# EAGLE design BeanCounter_V10 (EAGLE 9.6.2)
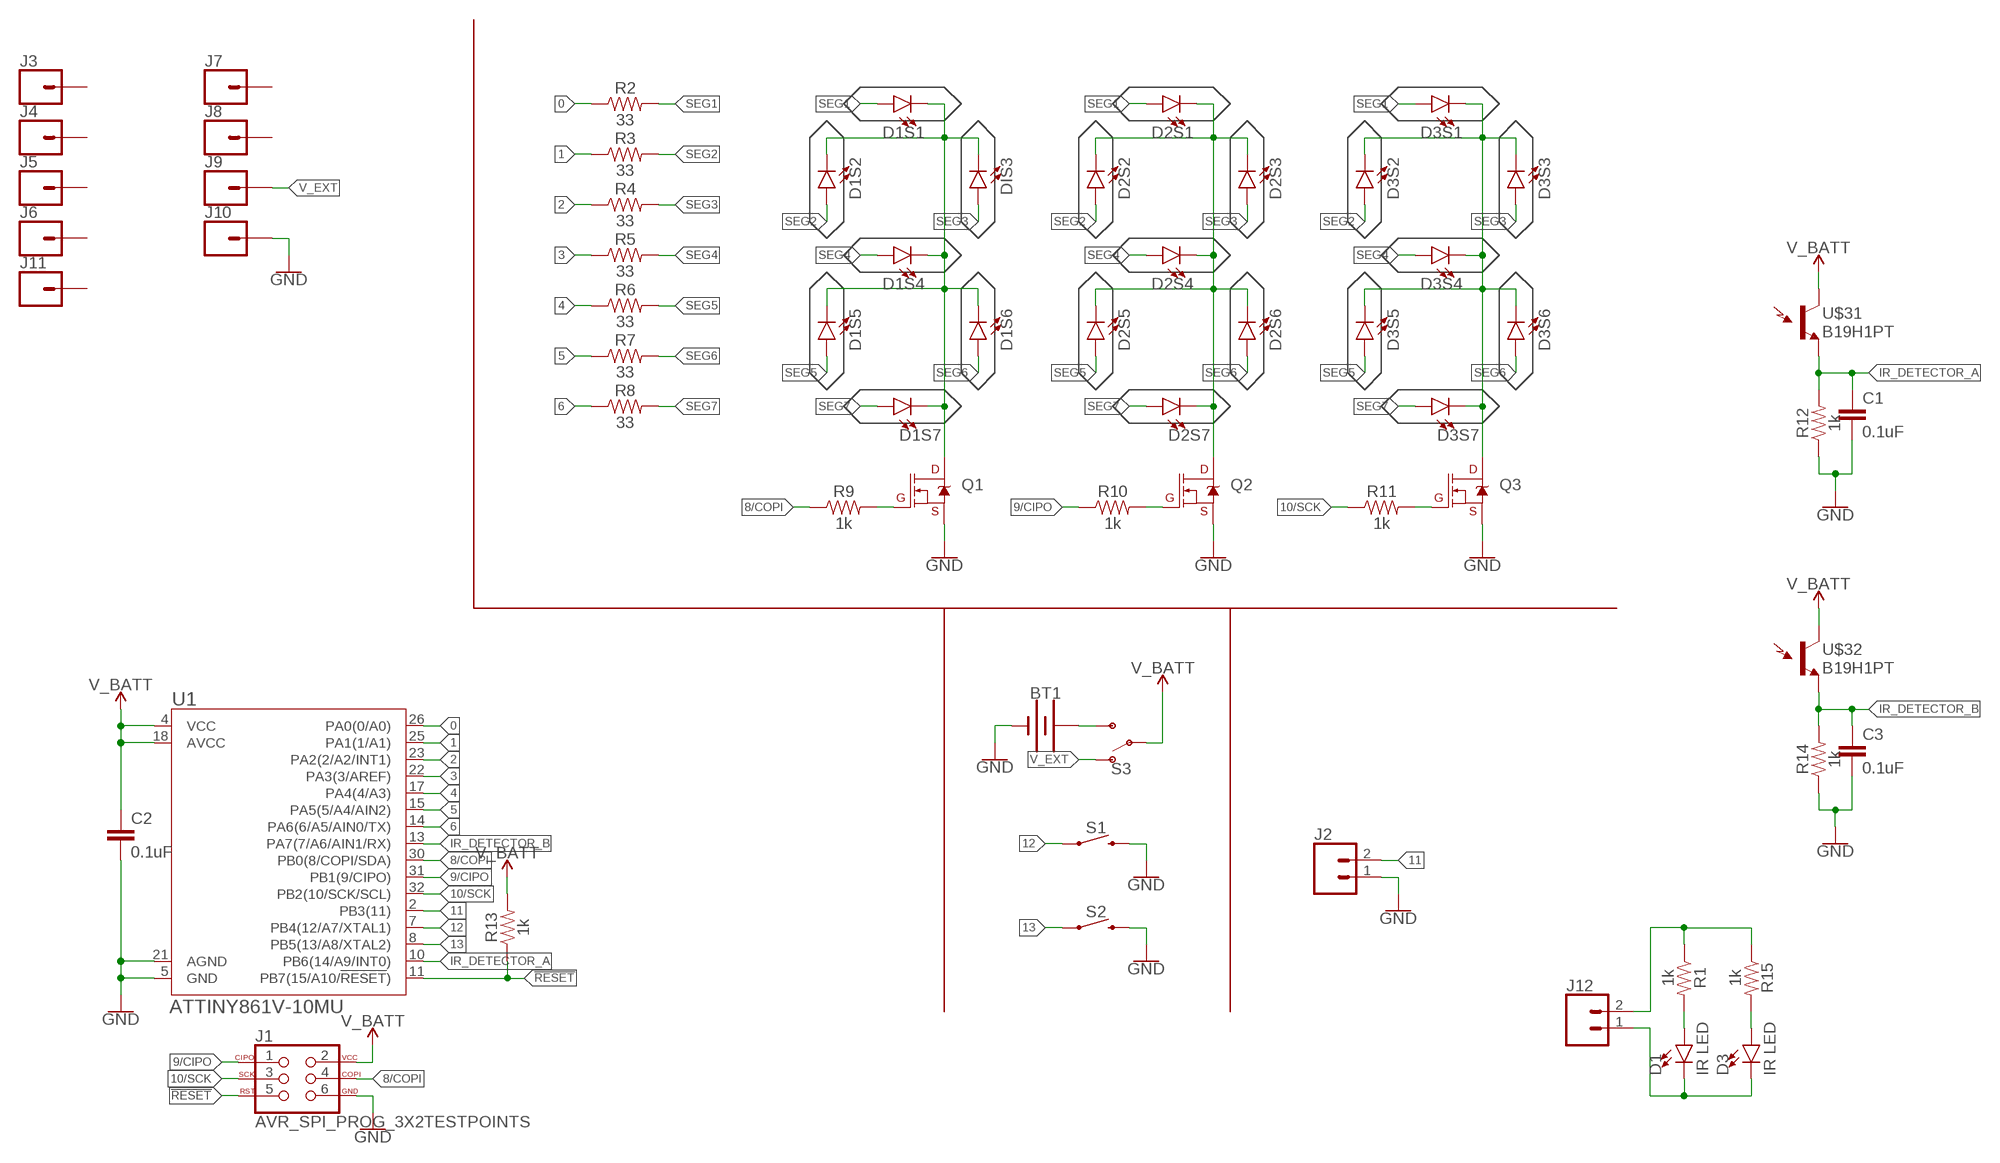
[diagram p0: schematic, sheet 1]

## Parts
BT1  BATTERY-20MM_SMD_4LEGS_OVERPASTE_INNER  [BATTCON_20MM_4LEGS_OVERPASTE_INNER]
C1  0.1uF  0.1UF-0603-25V-(+80/-20%)  [0603]
C2  0.1uF  0.1UF-0603-25V-(+80/-20%)  [0603]
C3  0.1uF  0.1UF-0603-25V-(+80/-20%)  [0603]
D1  IR LED  LED-IR0603  [LED-0603]
D1S1  LED0603  [LED-0603]
D1S2  LED0603  [LED-0603]
D1S4  LED0603  [LED-0603]
D1S5  LED0603  [LED-0603]
D1S6  LED0603  [LED-0603]
D1S7  LED0603  [LED-0603]
D2S1  LED0603  [LED-0603]
D2S2  LED0603  [LED-0603]
D2S3  LED0603  [LED-0603]
D2S4  LED0603  [LED-0603]
D2S5  LED0603  [LED-0603]
D2S6  LED0603  [LED-0603]
D2S7  LED0603  [LED-0603]
D3  IR LED  LED-IR0603  [LED-0603]
D3S1  LED0603  [LED-0603]
D3S2  LED0603  [LED-0603]
D3S3  LED0603  [LED-0603]
D3S4  LED0603  [LED-0603]
D3S5  LED0603  [LED-0603]
D3S6  LED0603  [LED-0603]
D3S7  LED0603  [LED-0603]
DIS3  LED0603  [LED-0603]
J1  AVR_SPI_PROG_3X2TESTPOINTS  [2X3_TEST_POINTS]
J2  CONN_02  [1X02]
J3  CONN_01  [1X01]
J4  CONN_01  [1X01]
J5  CONN_01  [1X01]
J6  CONN_01  [1X01]
J7  CONN_01  [1X01]
J8  CONN_01  [1X01]
J9  CONN_01  [1X01]
J10  CONN_01  [1X01]
J11  CONN_01  [1X01]
J12  CONN_02  [1X02]
Q1  220mA/50V/3.5Ω  MOSFET-NCH-BSS138  [SOT23-3]
Q2  220mA/50V/3.5Ω  MOSFET-NCH-BSS138  [SOT23-3]
Q3  220mA/50V/3.5Ω  MOSFET-NCH-BSS138  [SOT23-3]
R1  1k  1KOHM-0603-1/10W-1%  [0603]
R2  33  33OHM-0603-1/10W-1%  [0603]
R3  33  33OHM-0603-1/10W-1%  [0603]
R4  33  33OHM-0603-1/10W-1%  [0603]
R5  33  33OHM-0603-1/10W-1%  [0603]
R6  33  33OHM-0603-1/10W-1%  [0603]
R7  33  33OHM-0603-1/10W-1%  [0603]
R8  33  33OHM-0603-1/10W-1%  [0603]
R9  1k  1KOHM-0603-1/10W-1%  [0603]
R10  1k  1KOHM-0603-1/10W-1%  [0603]
R11  1k  1KOHM-0603-1/10W-1%  [0603]
R12  1k  1KOHM-0603-1/10W-1%  [0603]
R13  1k  1KOHM-0603-1/10W-1%  [0603]
R14  1k  1KOHM-0603-1/10W-1%  [0603]
R15  1k  1KOHM-0603-1/10W-1%  [0603]
S1  MOMENTARY-SWITCH-SPST-SMD-5.2MM-TALL  [TACTILE_SWITCH_SMD_5.2MM]
S2  MOMENTARY-SWITCH-SPST-SMD-5.2MM-TALL  [TACTILE_SWITCH_SMD_5.2MM]
S3  SWITCH-SPDT-SMD-RIGHT-ANGLE  [SWITCH_SPST_SMD_A]
U1  ATTINY861V-10MU  [32M1-A_ATM]
U$31  B19H1PT  [HARVATEK_DETECTOR]
U$32  B19H1PT  [HARVATEK_DETECTOR]

## Nets
0: R2.1 U1.26(PA0(0/A0))
1: R3.1 U1.25(PA1(1/A1))
2: R4.1 U1.23(PA2(2/A2/INT1))
3: R5.1 U1.22(PA3(3/AREF))
4: R6.1 U1.17(PA4(4/A3))
5: R7.1 U1.15(PA5(5/A4/AIN2))
6: R8.1 U1.14(PA6(6/A5/AIN0/TX))
8/COPI: J1.4 R9.1 U1.30(PB0(8/COPI/SDA))
9/CIPO: J1.1 R10.1 U1.31(PB1(9/CIPO))
10/SCK: J1.3 R11.1 U1.32(PB2(10/SCK/SCL))
11: J2.2 U1.2(PB3(11))
12: S1.1 U1.7(PB4(12/A7/XTAL1))
13: S2.1 U1.8(PB5(13/A8/XTAL2))
!RESET: J1.5 R13.1 U1.11(PB7(15/A10/!RESET!))
GND: BT1.2(-) C1.2 C2.2 C3.2 J1.6 J2.1 J10.1 Q1.2(S) Q2.2(S) Q3.2(S) R12.1 R14.1 S1.3 S2.3 U1.5(GND) U1.21(AGND)
IR_DETECTOR_A: C1.1 R12.2 U1.10(PB6(14/A9/INT0)) U$31.P$2(E1)
IR_DETECTOR_B: C3.1 R14.2 U1.13(PA7(7/A6/AIN1/RX)) U$32.P$2(E1)
N$1: BT1.1(+) S3.3(S)
N$4: D1S1.C D1S2.C D1S4.C D1S5.C D1S6.C D1S7.C DIS3.C Q1.3(D)
N$8: Q2.1(G) R10.2
N$9: Q1.1(G) R9.2
N$11: D2S1.C D2S2.C D2S3.C D2S4.C D2S5.C D2S6.C D2S7.C Q2.3(D)
N$13: Q3.1(G) R11.2
N$14: D3S1.C D3S2.C D3S3.C D3S4.C D3S5.C D3S6.C D3S7.C Q3.3(D)
N$31: D3.A R15.2
N$32: D1.A R1.2
N$44: J12.2 R1.1 R15.1
N$51: D1.C D3.C J12.1
SEG1: D1S1.A D2S1.A D3S1.A R2.2
SEG2: D1S2.A D2S2.A D3S2.A R3.2
SEG3: D2S3.A D3S3.A DIS3.A R4.2
SEG4: D1S4.A D2S4.A D3S4.A R5.2
SEG5: D1S5.A D2S5.A D3S5.A R6.2
SEG6: D1S6.A D2S6.A D3S6.A R7.2
SEG7: D1S7.A D2S7.A D3S7.A R8.2
V_BATT: C2.1 J1.2 R13.2 S3.2(P) U1.4(VCC) U1.18(AVCC) U$31.P$1(C1) U$32.P$1(C1)
V_EXT: J9.1 S3.1(O)
Unconnected: J3.1 J4.1 J5.1 J6.1 J7.1 J8.1 J11.1

## Library data of the parts
BT1 = SparkFun-Batteries:BATTERY: Battery - Single Cell A variety of battery chemistries, sizes, and footprints. Device List: 20MM_PTH - Coin Cell Battery Holder - 20mm (PTH) <https://www.sparkfun.com/products/783> 20MM_PTH_KIT- Coin Cell battery Holder - 20 mm (PTH) <http://www.sparkfun.com/products/783>kit version with special mask 6.8MM_PTH - Coin Cell Battery Holder - 6.8MM(SMD) <https://www.digikey.com/product-detail/en/seiko-instruments/MS621FE-FL11E/728-1057-ND/1889208?WT.srch=1&gclid=CNOQ5a6LzdQCFZS2wAodXCkE0g> 12MM_SMD - Coin Cell Battery Holder - 12mm (SMD) <https://www.sparkfun.com/products/10592> 12MM_PTH - Coin Cell Battery Holder - 12mm (PTH) <https://www.sparkfun.com/products/7948> 20MM_SMD - 20mm Coin Cell Battery Holder (SMD) (2 legs) Used on the Big Time Watch Kit <https://www.sparkfun.com/products/11734> 20MM_SMD_4LEGS - Coin Cell Battery Holder - 20mm (SMD) <https://www.sparkfun.com/products/11892> 20MM_SMD_4LEGS_OVERPASTE - Coin Cell Battery Holder - 20mm (SMD) <https://www.sparkfun.com/products/11892> (Over-paste on the legs) 24.5MM_PTH - Coin Cell Battery Holder - 24.5mm (PTH) <https://www.sparkfun.com/products/8863> 9V - 9V Battery Holder - PC Mount Used on the SparkFun SparkPunk Sound Kit <https://www.sparkfun.com/products/11177> and SparkFun SparkPunk Sequencer Kit <https://www.sparkfun.com/products/12707> 18650 - Battery Holder - 18650 (PTH) <https://www.sparkfun.com/products/13113> AA - Battery Holder - 1xAA (PTH) <https://www.sparkfun.com/products/7949> AAA - Battery Holder - 1xAAA (PTH) <https://www.sparkfun.com/products/12718> AA_KIT - Battery Holder - 1xAA (PTH) <https://www.sparkfun.com/products/7949> Special kit package - pads only have exposed copper on one side of the board. AAA_KIT - Battery Holder - 1xAAA (PTH) <https://www.sparkfun.com/products/12718> Special kit package - pads only have exposed copper on one side of the board.
C1-C3 = SparkFun-Capacitors:0.1UF: 0.1µF ceramic capacitors A capacitor is a passive two-terminal electrical component used to store electrical energy temporarily in an electric field.; PROD_ID: CAP-00810
D1 D3 = SparkFun-LED:LED-IR: Infrared LED (IR) Wavelength: 940nm Packages: TSAL6100 LTE302 - Side firing. Check SparkFun-Sensors.lbr for the receiver SparkFun Products: ZX Distance and Gesture Sensor <[https://www.sparkfun.com/products/12780]> Infrared Emitters and Detectors <https://www.sparkfun.com/products/241>; PROD_ID: DIO-14125
D1S1 D1S2 D1S4-D1S7 D2S1-D2S7 D3S1-D3S7 DIS3 = SparkFun-LED:LED: LED (Generic) Standard schematic elements and footprints for 5mm, 3mm, 1206, and 0603 sized LEDs. Generic LEDs with no color specified.
J1 = SparkFun-Connectors:AVR_SPI_PROG_3X2: AVR ISP 6 Pin This is the reduced ISP connector for AVR programming. Common on Arduino. This footprint will take up less PCB space and can be used with a 10-pin to 6-pin adapter such as SKU: BOB-08508 **Special note about "TEST_POINT" package. The stop mask is on the top side, so if you want your programming test points to be on the bottom of your board, make sure to place this package on the bottom side of the board. This also ensure that the orientation to program from the bottom side will be correct. SparkFun Products: SparkFun ISP Pogo Adapter <https://www.sparkfun.com/products/11591> - NS Tiny AVR Programmer <https://www.sparkfun.com/products/11801> -PTH
J2 J12 = SparkFun-Connectors:CONN_02: Multi connection point. Often used as Generic Header-pin footprint for 0.1 inch spaced/style header connections On any of the 0.1 inch spaced packages, you can populate with these: Break Away Headers - Straight <https://www.sparkfun.com/products/116> (PRT-00116) Break Away Male Headers - Right Angle <https://www.sparkfun.com/products/553> (PRT-00553) Female Headers <https://www.sparkfun.com/products/115> (PRT-00115) Break Away Headers - Machine Pin <https://www.sparkfun.com/products/117> (PRT-00117) Break Away Female Headers - Swiss Machine Pin <https://www.sparkfun.com/products/743> (PRT-00743) For SCREWTERMINALS and SPRING TERMINALS visit here: Screw Terimnals on SparkFun.com <https://www.sparkfun.com/search/results?term=Screw+Terminals> (5mm/3.5mm/2.54mm spacing) This device is also useful as a general connection point to wire up your design to another part of your project. Our various solder wires solder well into these plated through hole pads. Hook-Up Wire - Assortment (Stranded, 22 AWG) <https://www.sparkfun.com/products/11375> (PRT-11375) Hook-Up Wire - Assortment (Solid Core, 22 AWG) <https://www.sparkfun.com/products/11367> (PRT-11367) View the entire wire category on our website here <https://www.sparkfun.com/categories/141> Special notes: Molex polarized connector foot print use with: PRT-08233 with associated crimp pins and housings. 2.54_SCREWTERM for use with PRT-10571. 3.5mm Screw Terminal footprints for PRT-08084 5mm Screw Terminal footprints for use with PRT-08432
J3-J11 = SparkFun-Connectors:CONN_01: Single connection point. Often used as Generic Header-pin footprint for 0.1 inch spaced/style header connections On any of the 0.1 inch spaced packages, you can populate with these: Break Away Headers - Straight <https://www.sparkfun.com/products/116> (PRT-00116) Break Away Male Headers - Right Angle <https://www.sparkfun.com/products/553> (PRT-00553) Female Headers <https://www.sparkfun.com/products/115> (PRT-00115) Break Away Headers - Machine Pin <https://www.sparkfun.com/products/117> (PRT-00117) Break Away Female Headers - Swiss Machine Pin <https://www.sparkfun.com/products/743> (PRT-00743) This device is also useful as a general connection point to wire up your design to another part of your project. Our various solder wires solder well into these plated through hole pads. Hook-Up Wire - Assortment (Stranded, 22 AWG) <https://www.sparkfun.com/products/11375> (PRT-11375) Hook-Up Wire - Assortment (Solid Core, 22 AWG) <https://www.sparkfun.com/products/11367> (PRT-11367) View the entire wire category on our website here <https://www.sparkfun.com/categories/141> Special notes: SMTSO-256-ET is a "flush mount" nut for a 4-40 screw. We mostly use this on specialty testbeds; it is a nice way to connect hardware to your PCB at an adjustable hieght. Also note, the SNAP packages are for using a snappable style connector. We sell a baggie of snaps and they are also used on two LilyPad designs: Snap Assortment - 30 pack (male and female) <https://www.sparkfun.com/products/11347> (DEV-11347) LilyPad Arduino SimpleSnap <https://www.sparkfun.com/products/10941> (DEV-10941) LilyPad SimpleSnap Protoboard <https://www.sparkfun.com/products/10940> (DEV-10940)
Q1-Q3 = SparkFun-DiscreteSemi:MOSFET-NCH: N-channel MOSFETs Voltage controlled devices that allow control of high current outputs. SparkFun Products: SparkFun OpenScale <https://www.sparkfun.com/products/13261> SparkFun Digital Sandbox <https://www.sparkfun.com/products/12651> SparkFun Monster Moto Shield <https://www.sparkfun.com/products/10182> SparkFun MOSFET Power Controller <https://www.sparkfun.com/products/11214>; PROD_ID: TRANS-00830
R1 R9-R15 = SparkFun-Resistors:1KOHM: 1kΩ resistor A resistor is a passive two-terminal electrical component that implements electrical resistance as a circuit element. Resistors act to reduce current flow, and, at the same time, act to lower voltage levels within circuits. - Wikipedia; PROD_ID: RES-07856
R2-R8 = SparkFun-Resistors:33OHM: 33Ω resistor A resistor is a passive two-terminal electrical component that implements electrical resistance as a circuit element. Resistors act to reduce current flow, and, at the same time, act to lower voltage levels within circuits. - Wikipedia; PROD_ID: RES-08270
S1 S2 = SparkFun-Switches:MOMENTARY-SWITCH-SPST: Momentary Switch (Pushbutton) - SPST Normally-open (NO) SPST momentary switches (buttons, pushbuttons). Variants PTH-12MM - 12mm square, through-hole Momentary Pushbutton Switch - 12mm Square <https://www.sparkfun.com/products/9190> (COM-09190) PTH-6.0MM, PTH-6.0MM-KIT - 6.0mm square, through-hole Mini Pushbutton Switch <https://www.sparkfun.com/products/97> (COM-00097) KIT package intended for soldering kit's - only one side of pads' copper is exposed. PTH-RIGHT-ANGLE-KIT - Right-angle, through-hole Right Angle Tactile Button <https://www.sparkfun.com/products/10791> - Used on SparkFun BigTime Watch Kit <https://www.sparkfun.com/products/11734> SMD-12MM - 12mm square, surface-mount Tactile Button - SMD (12mm) <https://www.sparkfun.com/products/12993> (COM-12993) Used on SparkFun PicoBoard <https://www.sparkfun.com/products/11888> SMD-4.5MM - 4.5mm Square Trackball Switch Used on SparkFun Blackberry Trackballer Breakout <https://www.sparkfun.com/products/13169> SMD-4.6MMX2.8MM - 4.60mm x 2.80mm, surface mount Used on SparkFun Pro Micro - RP2040 <https://www.sparkfun.com/products/17717> SMD-5.2MM, SMD-5.2-REDUNDANT - 5.2mm square, surface-mount Mini Pushbutton Switch - SMD <https://www.sparkfun.com/products/8720> (COM-08720) Used on Arduino Pro Mini <https://www.sparkfun.com/products/11114> REDUNDANT package connects both switch circuits together SMD-6.0X3.5MM - 6.0 x 3.5mm, surface mount Momentary Reset Switch SMD <https://www.sparkfun.com/products/8229> (COM-08229) SMD-6.2MM-TALL - 6.2mm square, surface mount Tactile Button - SMD (6mm) <https://www.sparkfun.com/products/12992> Used on SparkFun Digital Sandbox <https://www.sparkfun.com/products/12651> SMD-RIGHT-ANGLE - Right-angle, surface mount Used on SparkFun Block for Intel® Edison - Arduino <https://www.sparkfun.com/products/13036>; PROD_ID: SWCH-14139
S3 = SparkFun-Switches:SWITCH-SPDT: Single Pole, Double Throw (SPDT) Switch Single-pole, double-throw (SPDT) switch. Variant Overview SMD-AYZ0202 Surface Mount DPDT Switch <https://www.sparkfun.com/products/597> (COM-00597) Used on e.g. LilyPad Arduino USB - ATmega32U4 Board <https://www.sparkfun.com/products/12049> PTH-11.6X4.0MM SPDT Mini Power Switch <https://www.sparkfun.com/products/102> (COM-00102) Used on e.g. SparkFun Simon Says - Through-Hole Soldering Kit <https://www.sparkfun.com/products/10547> (KIT-10547) PTH-11.6X4.0MM-KIT KIT version of SPDT Mini Power Switch - Simplifies soldering by removing tStop of switch pins - only one side can be soldered. PTH-11.6X4.0MM-LOCK LOCK version of SPDT Mini Power Switch - Offset pins hold switch in place for easier soldering. SMD-RIGHT-ANGLE Surface Mount Right Angle Switch <https://www.sparkfun.com/products/10860> (COM-10860) Used on e.g. SparkFun ESP8266 Thing <https://www.sparkfun.com/products/13231>; PROD_ID: SWCH-10651; SF_SKU: COM-10860
U1 = Melodica:ATTINY861V-10MU; COPYRIGHT: Copyright (C) 2021 Ultra Librarian. All rights reserved.; DIGI-KEY_PART_NUMBER_1: ATTINY861V-10MU-ND; DIGI-KEY_PART_NUMBER_2: 2156-ATTINY861V-10MU-ND; MANUFACTURER_PART_NUMBER: ATTINY861V-10MU; MFR_NAME: Microchip
U$31 U$32 = IR:B19H1PT

## Board
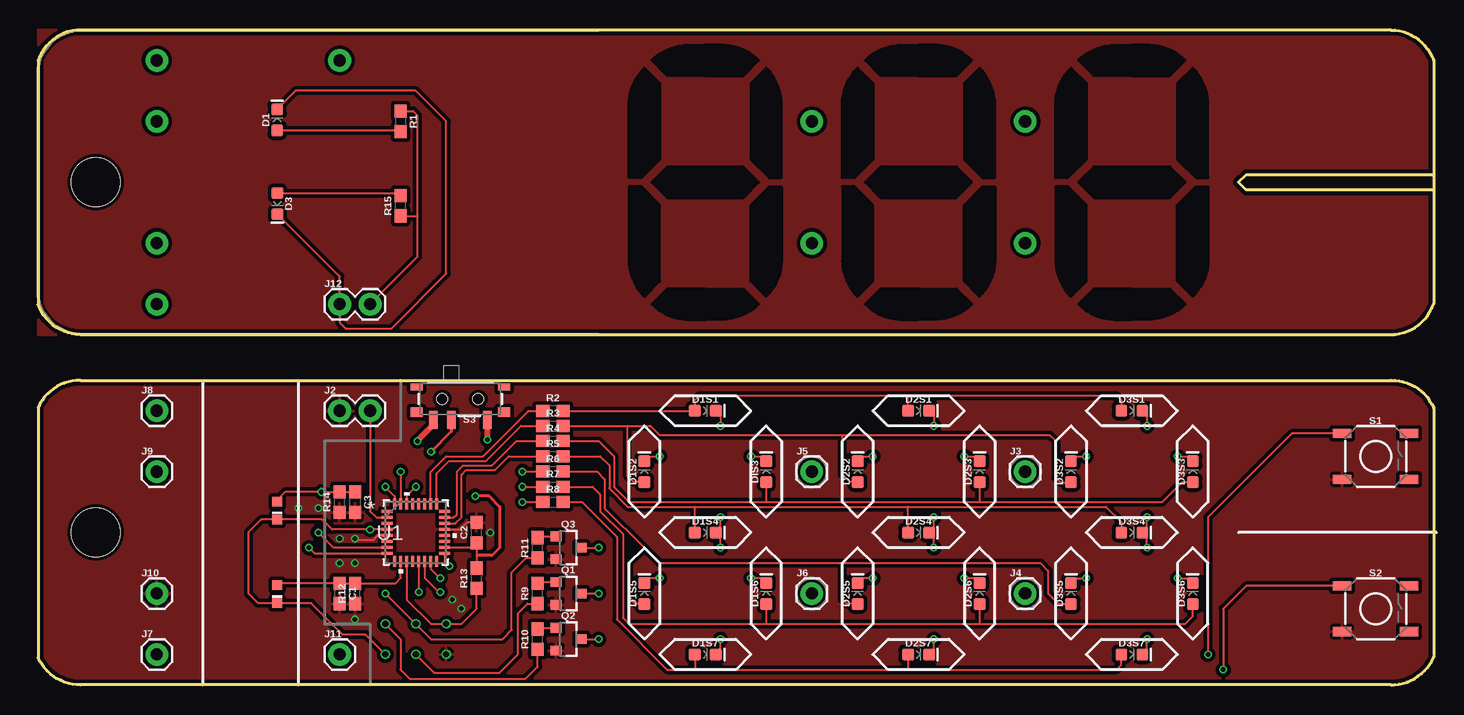
[diagram p1: board, top side]
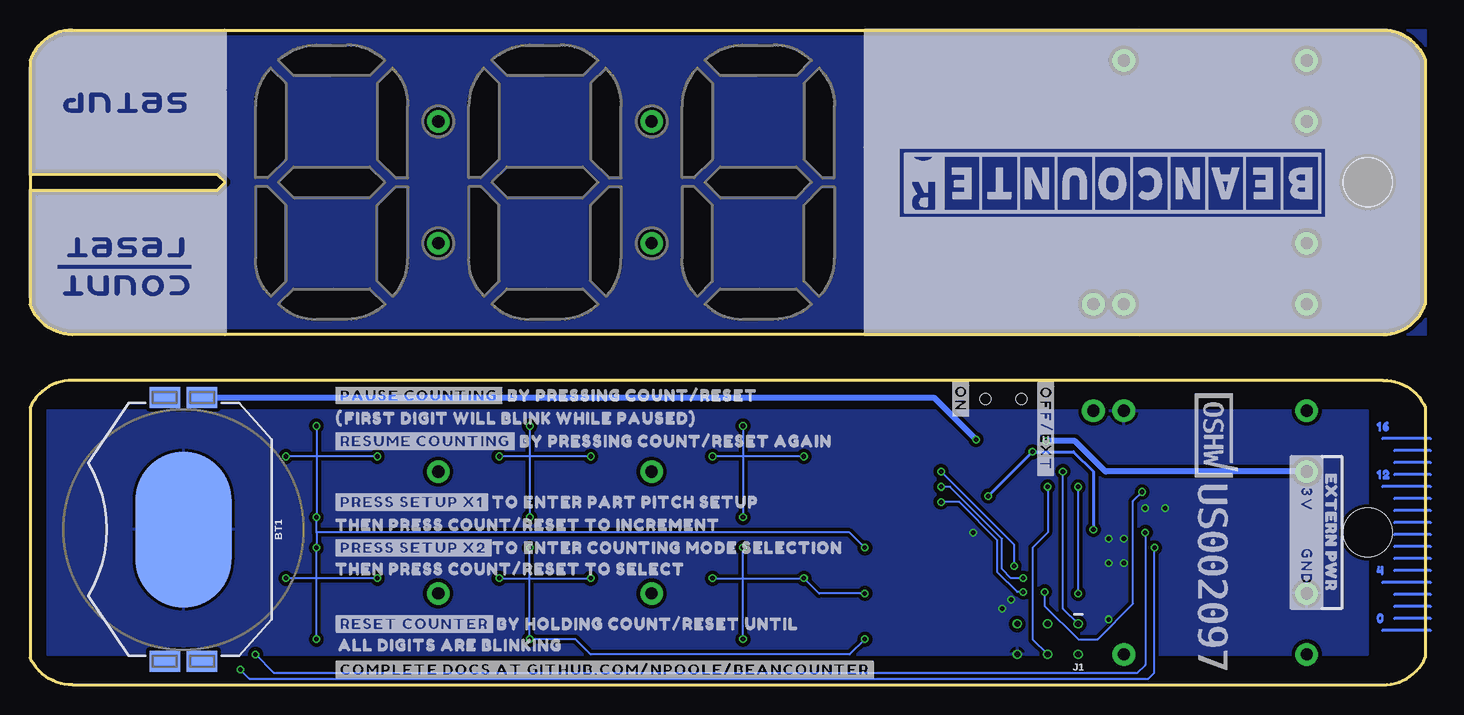
[diagram p2: board, bottom side, seen from below]

Size 116.33 x 54.61 mm. Coordinates in mm from the lower left corner, seen from the top.
Outline: 116.33,41.27 100.71,41.27 100.08,41.91 100.71,42.55 116.33,42.55
Outline: 23.88,29.21 46.74,29.21
Outline: 46.74,54.61 23.88,54.61
Outline: 3.56,25.4 112.78,25.4 arc-67 116.33,23.11 116.33,2.29 arc-67 112.78,0 3.56,0 arc-67 0,2.29 0,23.11 arc-67 3.56,25.4
Outline: 3.56,29.21 112.78,29.21 arc70 116.33,31.75 116.33,52.07 arc70 112.78,54.61 3.56,54.61 arc70 0,52.07 0,31.75 arc70 3.56,29.21
Copper layers (1*16): Top 0.035mm / dielectric 30mil / Bottom 0.035mm
Design rules "SparkFun-2-Layer-Minimum-JLCPCB *": minimum track width 5mil, minimum drill 0.3mm, track to track 5mil, track to pad 5mil, pad to pad 5mil, via to via 5mil, smd to smd 5mil, copper to edge 7mil, drill to drill 7mil, minimum pad ring 5mil, minimum via ring 5mil, stop-mask expansion 4mil, vias tented up to drill 25mil, thermal gap 10mil
Holes 4.06 mm at 4.83,12.7 4.83,41.91

### Footprints (pad centres in the part's own frame; a part is rotated, then mirrored left to right if it is on the bottom)
BATTCON_20MM_4LEGS_OVERPASTE_INNER = smd 1.778 x 2.54: 1 -11,1.55; 3 11,1.55; P$1 -11,-1.55; P$2 11,-1.55 | smd 13 x 8: 2 0,0
0603 = smd 1.1 x 1: 1 -0.85,0; 2 0.85,0
LED-0603 = smd 1 x 1: A -0.877,0; C 0.877,0
2X3_TEST_POINTS = drill 0.508: 1 -2.54,-1.27; 2 -2.54,1.27; 3 0,-1.27; 4 0,1.27; 5 2.54,-1.27; 6 2.54,1.27
1X02 = drill 1.016 pad 1.88: 1 0,0; 2 2.54,0
1X01 = drill 1.016 pad 1.88: 1 0,0
SOT23-3 = smd 0.8 x 0.9: 1 -0.95,-1; 2 0.95,-1; 3 0,1.1
TACTILE_SWITCH_SMD_5.2MM = smd 1.524 x 0.762: 1 -2.794,1.905; 2 2.794,1.905; 3 -2.794,-1.905; 4 2.794,-1.905
SWITCH_SPST_SMD_A = smd 0.7 x 1.5: 1 -2.25,-1.75; 2 -0.75,-1.75; 3 2.25,-1.75 | smd 1 x 0.6: GND1 -3.65,1; GND3 3.65,1 | smd 1 x 0.8: GND2 -3.65,-1.1; GND4 3.65,-1.1 | hole 0.9: -1.5,0; 1.5,0
32M1-A_ATM = smd 0.914 x 0.254: 1 -2.4,1.75; 2 -2.4,1.25; 3 -2.4,0.75; 4 -2.4,0.25; 5 -2.4,-0.25; 6 -2.4,-0.75; 7 -2.4,-1.25; 8 -2.4,-1.75; 17 2.4,-1.75; 18 2.4,-1.25; 19 2.4,-0.75; 20 2.4,-0.25; 21 2.4,0.25; 22 2.4,0.75; 23 2.4,1.25; 24 2.4,1.75 | smd 0.254 x 0.914: 9 -1.75,-2.4; 10 -1.25,-2.4; 11 -0.75,-2.4; 12 -0.25,-2.4; 13 0.25,-2.4; 14 0.75,-2.4; 15 1.25,-2.4; 16 1.75,-2.4; 25 1.75,2.4; 26 1.25,2.4; 27 0.75,2.4; 28 0.25,2.4; 29 -0.25,2.4; 30 -0.75,2.4; 31 -1.25,2.4; 32 -1.75,2.4
HARVATEK_DETECTOR = smd 0.8 x 0.8: P$1 0,0.75; P$2 0,-0.75

### Placement (x,y rotation side)
BT1  103.54,12.96 270 bottom
C1  25.15,7.62 270 top
C2  36.58,12.7 90 top
C3  26.42,15.24 270 top
D1  19.94,47.12 90 top
D1S1  55.63,22.86 0 top
D1S2  50.55,17.78 90 top
D1S4  55.63,12.7 0 top
D1S5  50.55,7.62 90 top
D1S6  60.71,7.62 90 top
D1S7  55.63,2.54 0 top
D2S1  73.41,22.86 0 top
D2S2  68.33,17.78 90 top
D2S3  78.49,17.78 90 top
D2S4  73.41,12.7 0 top
D2S5  68.33,7.62 90 top
D2S6  78.49,7.62 90 top
D2S7  73.41,2.54 0 top
D3  19.96,40.13 270 top
D3S1  91.19,22.86 0 top
D3S2  86.11,17.78 90 top
D3S3  96.27,17.78 90 top
D3S4  91.19,12.7 0 top
D3S5  86.11,7.62 90 top
D3S6  96.27,7.62 90 top
D3S7  91.19,2.54 0 top
DIS3  60.71,17.78 90 top
J1  31.5,3.81 180 bottom
J2  25.15,22.86 0 top
J3  82.3,17.78 0 top
J4  82.3,7.62 0 top
J5  64.52,17.78 0 top
J6  64.52,7.62 0 top
J7  9.91,2.54 0 top
J8  9.91,22.86 0 top
J9  9.91,17.78 0 top
J10  9.91,7.62 0 top
J11  25.15,2.54 0 top
J12  25.15,31.75 0 top
Q1  44.2,7.62 270 top
Q2  44.2,3.81 270 top
Q3  44.2,11.43 270 top
R1  30.23,46.99 270 top
R2  42.93,22.86 0 top
R3  42.93,21.59 0 top
R4  42.93,20.32 0 top
R5  42.93,19.05 0 top
R6  42.93,17.78 0 top
R7  42.93,16.51 0 top
R8  42.93,15.24 0 top
R9  41.66,7.62 90 top
R10  41.66,3.81 90 top
R11  41.66,11.43 90 top
R12  26.42,7.62 90 top
R13  36.58,8.89 90 top
R14  25.15,15.24 90 top
R15  30.25,39.95 90 top
S1  111.51,19.05 0 top
S2  111.51,6.35 0 top
S3  35.21,23.83 0 top
U1  31.5,12.7 0 top
U$1  [OSHWBC#SVG0]  18.03,24.26 270 bottom
U$2  [EXTERN_PWR0]  7.87,12.7 270 bottom
U$3  [#PAUSE_COUNTING#0]  91.19,24.13 0 bottom
U$4  [#PRESS_SETUP_X1#0]  91.19,15.24 0 bottom
U$5  [00]  4.59,5.54 0 bottom
U$6  [#_3V#0]  9.91,17.53 270 bottom
U$7  [#_GND#0]  9.91,12.45 270 bottom
U$8  [THEN_PRESS_COUNT#RESET_TO_INCREMENT0]  91.57,13.34 0 bottom
U$9  [BY_PRESSING_COUNT#RESET0]  77.22,24.13 0 bottom
U$10  [FIRST_DIGIT_WILL_BLINK_WHILE_PAUSED#_0]  90.8,22.22 0 bottom
U$11  [#_0]  89.66,22.22 180 bottom
U$12  [#RESUME_COUNTING#0]  91.19,20.32 0 bottom
U$13  [BY_PRESSING_COUNT#RESET_AGAIN0]  76.2,20.32 0 bottom
U$14  [TO_ENTER_PART_PITCH_SETUP0]  78.49,15.24 0 bottom
U$15  [#PRESS_SETUP_X2#0]  91.19,11.43 0 bottom
U$16  [TO_ENTER_COUNTING_MODE_SELECTION0]  78.49,11.43 0 bottom
U$17  [THEN_PRESS_COUNT#RESET_TO_SELECT0]  91.57,9.65 0 bottom
U$18  [#RESET_COUNTER#0]  91.19,5.08 0 bottom
U$19  [BY_HOLDING_COUNT#RESET_UNTIL0]  78.1,5.08 0 bottom
U$20  [40]  4.59,9.54 0 bottom
U$21  [120]  4.59,17.54 0 bottom
U$22  [160]  4.59,21.54 0 bottom
U$23  [#ON#0]  38.76,22.09 270 bottom
U$24  [#OFF#EXT#0]  31.66,17.13 270 bottom
U$25  [ALL_DIGITS_ARE_BLINKING0]  91.31,3.3 0 bottom
U$26  [#COMPLETE_DOCS_AT_GITHUB#COM#NPOOLE#BEANCOUNTER#0]  91.19,1.27 0 bottom
U$27  [#COUNT#0]  108.46,33.27 180 bottom
U$28  [#RESET#0]  108.46,36.45 180 bottom
U$29  [#SETUP#0]  108.46,48.51 180 bottom
U$30  [LOGO#SVG0]  8.64,44.45 180 bottom
U$31  19.94,7.56 180 top
U$32  19.94,14.54 180 top

### Tracks (layer width: path | path; a pad name or v marks a point on that pad's centre or on a via)
0
  Top 0.152: U1.26 32.75,17.76 34.04,19.05 37.08,19.05 40.89,22.86 R2.1
1
  Top 0.152: U1.25 33.25,17.62 34.29,18.67 37.34,18.67 40.26,21.59 R3.1
2
  Top 0.152: U1.23 34.65,13.95 34.93,14.22 34.93,17.78 35.43,18.29 37.85,18.29 39.88,20.32 R4.1
3
  Top 0.152: U1.22 34.79,13.45 35.31,13.97 35.31,17.53 35.69,17.91 38.1,17.91 39.24,19.05 R5.1
4  (via drill 0.38)
  Top 0.152: U1.17 33.9,10.3 v34.29,9.91 | v40.39,17.78 R6.1
  Bottom 0.152: v34.29,9.91 34.29,11.68 v40.39,17.78
5  (via drill 0.38)
  Top 0.152: U1.15 32.75,9.67 v33.53,8.89 | v40.39,16.51 R7.1
  Bottom 0.152: v33.53,8.89 34.54,8.89 35.31,9.65 35.31,12.19 39.62,16.51 v40.39,16.51
6  (via drill 0.38)
  Top 0.152: U1.14 32.25,8.9 33.4,7.75 v33.53,7.75 | v40.39,15.24 R8.1
  Bottom 0.152: v33.53,7.75 34.04,7.75 35.69,9.4 35.69,12.07 38.86,15.24 v40.39,15.24
8/COPI  (via drill 0.38)
  Top 0.152: v31.5,16.51 30.75,15.76 U1.30 | R9.1 40.81,6.77 40.01,5.97 40.01,2.54 38.48,1.02 33.02,1.02 J1.4
  Bottom 0.152: v31.5,16.51 31.5,12.7 32.77,11.43 32.77,3.81 J1.4
9/CIPO  (via drill 0.38)
  Top 0.152: v30.23,17.78 30.25,17.76 U1.31 | J1.1 30.23,3.81 30.23,1.27 30.99,0.51 40.64,0.51 41.66,1.52 R10.1
  Bottom 0.152: J1.1 30.23,6.35 v30.23,17.78
10/SCK  (via drill 0.38)
  Top 0.152: v28.96,7.62 J1.3 32.77,3.81 38.73,3.81 39.5,4.57 39.5,9.4 40.68,10.58 R11.1 | v28.96,16.51 29.75,15.72 U1.32
  Bottom 0.152: v28.96,7.62 v28.96,16.51
11
  Top 0.152: J2.2 27.69,14.48 28.21,13.95 U1.2
12  (via drill 0.38)
  Top 0.152: S1.1 104.52,20.95 97.54,13.97 v97.54,2.54 | v23.37,12.7 24.62,11.45 U1.7
  Bottom 0.152: v97.54,2.54 96.01,1.02 24,1.02 23.37,1.65 v23.37,12.7
13  (via drill 0.38)
  Top 0.152: S2.1 100.71,8.25 98.81,6.35 v98.81,1.27 | v22.59,11.43 23.07,10.95 U1.8
  Bottom 0.152: v98.81,1.27 98.04,0.51 23.11,0.51 22.61,1.02 v22.61,11.43 v22.59,11.43
!RESET
  Top 0.152: R13.1 36.58,6.35 35.31,5.08 J1.5 32.77,5.08 30.75,7.1 U1.11
GND  (via drill 0.38)
  Top 0.152: U1.21 34.67,12.95 | 34.67,12.95 | U1.5 28.32,12.45 27.94,12.07 26.54,12.07 v26.42,12.19 | 34.67,12.95 35.18,12.95 35.81,13.59 36.54,13.59 C2.2
  other vias: 25.15,10.16 26.42,10.16 26.42,5.46 37.72,12.7 34.54,7.11 35.31,6.35 21.72,14.73 23.37,14.73 25.15,12.19
  pour Top (isolate 0.305): 0,25.4 116.33,25.4 116.33,0 0,0
  pour Bottom (isolate 0.305): 4.83,22.86 114.86,22.86 114.86,2.54 4.83,2.54
IR_DETECTOR_A
  Top 0.152: U1.10 30.25,8.91 29.81,8.47 R12.2 C1.1 20.1,8.47 U$31.P$2
IR_DETECTOR_B  (via drill 0.38)
  Top 0.152: C3.1 R14.2 v23.62,16.09 20.62,16.09 19.94,15.41 U$32.P$2 | v31.75,7.75 U1.13
  Bottom 0.152: v31.75,7.75 31.75,6.6 28.96,3.81 27.33,3.81 24.38,6.76 24.38,15.33 v23.62,16.09
MASKBTM
  pour Top (isolate 0.305): 0,29.21 112.78,29.21 arc90 116.33,32.77 116.33,41.27 100.71,41.27 100.08,41.91 100.71,42.55 116.33,42.55 116.33,51.05 arc90 112.78,54.61 0,54.61
MASKTP
  pour Bottom (isolate 0.305): 0,29.21 112.78,29.21 arc90 116.33,32.77 116.33,41.27 100.71,41.27 100.08,41.91 100.71,42.55 116.33,42.55 116.33,51.05 arc90 112.78,54.61 0,54.61
N$1  (via drill 0.38)
  Top 0.508: v37.47,20.45 S3.3
  Bottom 0.508: BT1.1 40.98,23.96 v37.47,20.45
N$2
  Bottom 0.254: -0.41,4.54 3.59,4.54
N$3
  Bottom 0.254: -0.41,5.54 2.59,5.54
N$4  (via drill 0.38)
  Top 0.152: D1S1.C 56.9,22.86 v56.9,21.59 | v56.9,11.43 56.9,12.7 D1S4.C 56.9,13.09 v56.9,13.97 | D1S7.C 56.9,2.54 v56.9,3.81 | D1S2.C 50.55,19.05 v51.82,19.05 | v59.44,19.05 60.71,19.05 DIS3.C | D1S6.C 60.71,8.89 v59.44,8.89 | v51.82,8.89 50.55,8.89 D1S5.C | Q1.3 v46.74,7.62
  Bottom 0.152: v56.9,21.59 56.9,19.05 | 56.9,19.05 v56.9,13.97 | v56.9,3.81 56.9,8.89 | 56.9,8.89 v56.9,11.43 | v51.82,19.05 56.9,19.05 | 56.9,19.05 v59.44,19.05 | v59.44,8.89 56.9,8.89 | 56.9,8.89 v51.82,8.89 50.55,7.62 v46.74,7.62
N$5
  Bottom 0.254: -0.41,6.54 2.59,6.54
N$6
  Bottom 0.254: -0.41,7.54 2.59,7.54
N$7
  Bottom 0.254: -0.41,8.54 3.59,8.54
N$8
  Top 0.152: R10.2 41.76,4.76 Q2.1
N$9
  Top 0.152: R9.2 41.76,8.57 Q1.1
N$10
  Bottom 0.254: -0.41,9.54 2.59,9.54
N$11  (via drill 0.38)
  Top 0.152: D2S1.C 74.68,22.86 v74.68,21.59 | v74.68,11.43 74.68,12.7 D2S4.C 74.68,13.09 v74.68,13.97 | D2S7.C 74.68,2.54 v74.68,3.81 | D2S6.C 78.49,8.89 v77.22,8.89 | v69.6,8.89 68.33,8.89 D2S5.C | D2S2.C 68.33,19.05 v69.6,19.05 | v77.22,19.05 78.49,19.05 D2S3.C | Q2.3 v46.74,3.81
  Bottom 0.152: v74.68,21.59 74.68,19.05 | 74.68,19.05 v74.68,13.97 | 74.68,8.89 v74.68,3.81 70.87,3.81 69.6,2.54 48.01,2.54 v46.74,3.81 | 74.68,8.89 v74.68,11.43 | 74.68,8.89 v69.6,8.89 | v69.6,19.05 74.68,19.05 | 74.68,19.05 v77.22,19.05 | v77.22,8.89 74.68,8.89
N$12
  Bottom 0.254: -0.41,10.54 2.59,10.54
N$13
  Top 0.152: R11.2 41.76,12.38 Q3.1
N$14  (via drill 0.38)
  Top 0.152: D3S1.C 92.46,22.86 v92.46,21.59 | v92.46,11.43 92.46,12.7 D3S4.C 92.46,13.09 v92.46,13.97 | D3S7.C 92.46,2.54 v92.46,3.81 | D3S5.C 86.11,8.89 v87.38,8.89 | v95,8.89 96.27,8.89 D3S6.C | D3S2.C 86.11,19.05 v87.38,19.05 | v95,19.05 96.27,19.05 D3S3.C | Q3.3 v46.74,11.43
  Bottom 0.152: v92.46,21.59 92.46,19.05 | 92.46,19.05 v92.46,13.97 92.46,12.7 | v92.46,3.81 92.46,8.89 | 92.46,8.89 v92.46,11.43 92.46,12.7 | v87.38,8.89 92.46,8.89 | 92.46,8.89 v95,8.89 | v87.38,19.05 92.46,19.05 | 92.46,19.05 v95,19.05 | v46.74,11.43 48.01,12.7 92.46,12.7
N$15
  Bottom 0.254: -0.41,11.54 2.59,11.54
N$16
  Bottom 0.254: -0.41,12.54 2.59,12.54
N$17
  Bottom 0.254: -0.41,13.54 2.59,13.54
N$18
  Bottom 0.254: -0.41,14.54 2.59,14.54
N$19  (via drill 1.02 pad 1.88)
  other vias: 25.15,52.07
N$23  (via drill 1.02 pad 1.88)
  other vias: 27.69,31.75
N$24  (via drill 1.02 pad 1.88)
  other vias: 25.15,31.75
N$25  (via drill 1.02 pad 1.88)
  other vias: 25.15,52.07
N$26  (via drill 1.02 pad 1.88)
  other vias: 82.3,46.99
N$27  (via drill 1.02 pad 1.88)
  other vias: 82.3,36.83
N$28  (via drill 1.02 pad 1.88)
  other vias: 64.52,36.83
N$29  (via drill 1.02 pad 1.88)
  other vias: 64.52,46.99
N$31
  Top 0.152: D3.A 30.04,41.01 R15.2
N$32
  Top 0.152: D1.A 30.13,46.24 R1.2
N$37  (via drill 1.02 pad 1.88)
  other vias: 9.91,52.07
N$38  (via drill 1.02 pad 1.88)
  other vias: 9.91,31.75
N$39  (via drill 1.02 pad 1.88)
  other vias: 9.91,36.83
N$40  (via drill 1.02 pad 1.88)
  other vias: 9.91,46.99
N$41
  Bottom 0.254: -0.41,15.54 2.59,15.54
N$42
  Bottom 0.254: -0.41,16.54 3.59,16.54
N$43  (via drill 1.02 pad 1.88)
  other vias: 25.15,52.07
N$44
  Top 0.152: R1.1 31.28,47.84 31.62,47.5 31.62,39.12 | 31.62,39.12 31.62,35.69 J12.2 | R15.1 31.61,39.1 31.62,39.12
N$47
  Bottom 0.254: -0.41,17.54 2.59,17.54
N$48
  Bottom 0.254: -0.41,18.54 2.59,18.54
N$49
  Bottom 0.254: -0.41,19.54 2.59,19.54
N$50
  Bottom 0.254: -0.41,20.54 3.59,20.54
N$51
  Top 0.152: D1.C 21.47,49.53 31.5,49.53 34.04,46.99 34.04,34.29 29.46,29.72 25.65,29.72 25.15,30.23 J12.1 25.15,34.06 D3.C
N$52
  cutout Top: 55.63,30.48 55.63,33.02 58.8,33.02 60.07,31.75 59.79,31.5 59.56,31.32 59.33,31.17 59.08,31.01 58.83,30.89 58.52,30.76 58.14,30.63 57.81,30.56 57.45,30.51 57.15,30.48
N$53
  cutout Top: 60.71,32.38 59.44,33.66 59.44,40.01 60.96,41.53 61.98,41.53 61.98,35.33 61.95,35.03 61.9,34.67 61.85,34.44 61.8,34.26 61.7,33.96 61.62,33.78 61.49,33.5 61.34,33.22 61.19,32.97 60.96,32.66
N$54
  cutout Top: 55.63,30.48 55.63,33.02 52.45,33.02 51.18,31.75 51.46,31.5 51.69,31.32 51.92,31.17 52.17,31.01 52.43,30.89 52.73,30.76 53.11,30.63 53.44,30.56 53.8,30.51 54.1,30.48
N$55
  cutout Top: 50.55,32.38 51.82,33.66 51.82,40.01 50.29,41.53 49.28,41.53 49.28,35.33 49.3,35.03 49.35,34.67 49.4,34.44 49.45,34.26 49.56,33.96 49.63,33.78 49.76,33.5 49.91,33.22 50.06,32.97 50.29,32.66
N$56
  cutout Top: 55.63,53.34 55.63,50.8 58.8,50.8 60.07,52.07 59.79,52.32 59.56,52.5 59.33,52.65 59.08,52.81 58.83,52.93 58.52,53.06 58.14,53.19 57.81,53.26 57.45,53.31 57.15,53.34
N$57
  cutout Top: 60.71,51.44 59.44,50.16 59.44,43.81 60.96,42.29 61.98,42.29 61.98,48.49 61.95,48.79 61.9,49.15 61.85,49.38 61.8,49.56 61.7,49.86 61.62,50.04 61.49,50.32 61.34,50.6 61.19,50.85 60.96,51.16
N$58
  cutout Top: 55.63,53.34 55.63,50.8 52.45,50.8 51.18,52.07 51.46,52.32 51.69,52.5 51.92,52.65 52.17,52.81 52.43,52.93 52.73,53.06 53.11,53.19 53.44,53.26 53.8,53.31 54.1,53.34
N$59
  cutout Top: 50.55,51.44 51.82,50.16 51.82,43.81 50.29,42.29 49.28,42.29 49.28,48.49 49.3,48.79 49.35,49.15 49.4,49.38 49.45,49.56 49.56,49.86 49.63,50.04 49.76,50.32 49.91,50.6 50.06,50.85 50.29,51.16
N$60
  cutout Top: 51.18,41.91 52.45,40.64 58.8,40.64 60.07,41.91 58.8,43.18 52.45,43.18
N$61
  cutout Bottom: 55.63,30.48 55.63,33.02 58.8,33.02 60.07,31.75 59.79,31.5 59.56,31.32 59.33,31.17 59.08,31.01 58.83,30.89 58.52,30.76 58.14,30.63 57.81,30.56 57.45,30.51 57.15,30.48
N$62
  cutout Bottom: 60.71,32.38 59.44,33.66 59.44,40.01 60.96,41.53 61.98,41.53 61.98,35.33 61.95,35.03 61.9,34.67 61.85,34.44 61.8,34.26 61.7,33.96 61.62,33.78 61.49,33.5 61.34,33.22 61.19,32.97 60.96,32.66
N$63
  cutout Bottom: 55.63,30.48 55.63,33.02 52.45,33.02 51.18,31.75 51.46,31.5 51.69,31.32 51.92,31.17 52.17,31.01 52.43,30.89 52.73,30.76 53.11,30.63 53.44,30.56 53.8,30.51 54.1,30.48
N$64
  cutout Bottom: 50.55,32.38 51.82,33.66 51.82,40.01 50.29,41.53 49.28,41.53 49.28,35.33 49.3,35.03 49.35,34.67 49.4,34.44 49.45,34.26 49.56,33.96 49.63,33.78 49.76,33.5 49.91,33.22 50.06,32.97 50.29,32.66
N$65
  cutout Bottom: 55.63,53.34 55.63,50.8 58.8,50.8 60.07,52.07 59.79,52.32 59.56,52.5 59.33,52.65 59.08,52.81 58.83,52.93 58.52,53.06 58.14,53.19 57.81,53.26 57.45,53.31 57.15,53.34
N$66
  cutout Bottom: 60.71,51.44 59.44,50.16 59.44,43.81 60.96,42.29 61.98,42.29 61.98,48.49 61.95,48.79 61.9,49.15 61.85,49.38 61.8,49.56 61.7,49.86 61.62,50.04 61.49,50.32 61.34,50.6 61.19,50.85 60.96,51.16
N$67
  cutout Bottom: 55.63,53.34 55.63,50.8 52.45,50.8 51.18,52.07 51.46,52.32 51.69,52.5 51.92,52.65 52.17,52.81 52.43,52.93 52.73,53.06 53.11,53.19 53.44,53.26 53.8,53.31 54.1,53.34
N$68
  cutout Bottom: 50.55,51.44 51.82,50.16 51.82,43.81 50.29,42.29 49.28,42.29 49.28,48.49 49.3,48.79 49.35,49.15 49.4,49.38 49.45,49.56 49.56,49.86 49.63,50.04 49.76,50.32 49.91,50.6 50.06,50.85 50.29,51.16
N$69
  cutout Bottom: 51.18,41.91 52.45,40.64 58.8,40.64 60.07,41.91 58.8,43.18 52.45,43.18
N$70
  cutout Top: 73.41,30.48 73.41,33.02 76.58,33.02 77.85,31.75 77.57,31.5 77.34,31.32 77.11,31.17 76.86,31.01 76.61,30.89 76.3,30.76 75.92,30.63 75.59,30.56 75.23,30.51 74.93,30.48
N$71
  cutout Top: 78.49,32.38 77.22,33.66 77.22,40.01 78.74,41.53 79.76,41.53 79.76,35.33 79.73,35.03 79.68,34.67 79.63,34.44 79.58,34.26 79.48,33.96 79.4,33.78 79.27,33.5 79.12,33.22 78.97,32.97 78.74,32.66
N$72
  cutout Top: 73.41,30.48 73.41,33.02 70.23,33.02 68.96,31.75 69.24,31.5 69.47,31.32 69.7,31.17 69.95,31.01 70.21,30.89 70.51,30.76 70.89,30.63 71.22,30.56 71.58,30.51 71.88,30.48
N$73
  cutout Top: 68.33,32.38 69.6,33.66 69.6,40.01 68.07,41.53 67.06,41.53 67.06,35.33 67.08,35.03 67.13,34.67 67.18,34.44 67.23,34.26 67.34,33.96 67.41,33.78 67.54,33.5 67.69,33.22 67.84,32.97 68.07,32.66
N$74
  cutout Top: 73.41,53.34 73.41,50.8 76.58,50.8 77.85,52.07 77.57,52.32 77.34,52.5 77.11,52.65 76.86,52.81 76.61,52.93 76.3,53.06 75.92,53.19 75.59,53.26 75.23,53.31 74.93,53.34
N$75
  cutout Top: 78.49,51.44 77.22,50.16 77.22,43.81 78.74,42.29 79.76,42.29 79.76,48.49 79.73,48.79 79.68,49.15 79.63,49.38 79.58,49.56 79.48,49.86 79.4,50.04 79.27,50.32 79.12,50.6 78.97,50.85 78.74,51.16
N$76
  cutout Top: 73.41,53.34 73.41,50.8 70.23,50.8 68.96,52.07 69.24,52.32 69.47,52.5 69.7,52.65 69.95,52.81 70.21,52.93 70.51,53.06 70.89,53.19 71.22,53.26 71.58,53.31 71.88,53.34
N$77
  cutout Top: 68.33,51.44 69.6,50.16 69.6,43.81 68.07,42.29 67.06,42.29 67.06,48.49 67.08,48.79 67.13,49.15 67.18,49.38 67.23,49.56 67.34,49.86 67.41,50.04 67.54,50.32 67.69,50.6 67.84,50.85 68.07,51.16
N$78
  cutout Top: 68.96,41.91 70.23,40.64 76.58,40.64 77.85,41.91 76.58,43.18 70.23,43.18
N$79
  cutout Bottom: 73.41,30.48 73.41,33.02 76.58,33.02 77.85,31.75 77.57,31.5 77.34,31.32 77.11,31.17 76.86,31.01 76.61,30.89 76.3,30.76 75.92,30.63 75.59,30.56 75.23,30.51 74.93,30.48
N$80
  cutout Bottom: 78.49,32.38 77.22,33.66 77.22,40.01 78.74,41.53 79.76,41.53 79.76,35.33 79.73,35.03 79.68,34.67 79.63,34.44 79.58,34.26 79.48,33.96 79.4,33.78 79.27,33.5 79.12,33.22 78.97,32.97 78.74,32.66
N$81
  cutout Bottom: 73.41,30.48 73.41,33.02 70.23,33.02 68.96,31.75 69.24,31.5 69.47,31.32 69.7,31.17 69.95,31.01 70.21,30.89 70.51,30.76 70.89,30.63 71.22,30.56 71.58,30.51 71.88,30.48
N$82
  cutout Bottom: 68.33,32.38 69.6,33.66 69.6,40.01 68.07,41.53 67.06,41.53 67.06,35.33 67.08,35.03 67.13,34.67 67.18,34.44 67.23,34.26 67.34,33.96 67.41,33.78 67.54,33.5 67.69,33.22 67.84,32.97 68.07,32.66
N$83
  cutout Bottom: 73.41,53.34 73.41,50.8 76.58,50.8 77.85,52.07 77.57,52.32 77.34,52.5 77.11,52.65 76.86,52.81 76.61,52.93 76.3,53.06 75.92,53.19 75.59,53.26 75.23,53.31 74.93,53.34
N$84
  cutout Bottom: 78.49,51.44 77.22,50.16 77.22,43.81 78.74,42.29 79.76,42.29 79.76,48.49 79.73,48.79 79.68,49.15 79.63,49.38 79.58,49.56 79.48,49.86 79.4,50.04 79.27,50.32 79.12,50.6 78.97,50.85 78.74,51.16
N$85
  cutout Bottom: 73.41,53.34 73.41,50.8 70.23,50.8 68.96,52.07 69.24,52.32 69.47,52.5 69.7,52.65 69.95,52.81 70.21,52.93 70.51,53.06 70.89,53.19 71.22,53.26 71.58,53.31 71.88,53.34
N$86
  cutout Bottom: 68.33,51.44 69.6,50.16 69.6,43.81 68.07,42.29 67.06,42.29 67.06,48.49 67.08,48.79 67.13,49.15 67.18,49.38 67.23,49.56 67.34,49.86 67.41,50.04 67.54,50.32 67.69,50.6 67.84,50.85 68.07,51.16
N$87
  cutout Bottom: 68.96,41.91 70.23,40.64 76.58,40.64 77.85,41.91 76.58,43.18 70.23,43.18
N$88
  cutout Top: 91.19,30.48 91.19,33.02 94.36,33.02 95.63,31.75 95.35,31.5 95.12,31.32 94.89,31.17 94.64,31.01 94.39,30.89 94.08,30.76 93.7,30.63 93.37,30.56 93.01,30.51 92.71,30.48
N$89
  cutout Top: 96.27,32.38 95,33.66 95,40.01 96.52,41.53 97.54,41.53 97.54,35.33 97.51,35.03 97.46,34.67 97.41,34.44 97.36,34.26 97.26,33.96 97.18,33.78 97.05,33.5 96.9,33.22 96.75,32.97 96.52,32.66
N$90
  cutout Top: 91.19,30.48 91.19,33.02 88.01,33.02 86.74,31.75 87.02,31.5 87.25,31.32 87.48,31.17 87.73,31.01 87.99,30.89 88.29,30.76 88.67,30.63 89,30.56 89.36,30.51 89.66,30.48
N$91
  cutout Top: 86.11,32.38 87.38,33.66 87.38,40.01 85.85,41.53 84.84,41.53 84.84,35.33 84.86,35.03 84.91,34.67 84.96,34.44 85.01,34.26 85.12,33.96 85.19,33.78 85.32,33.5 85.47,33.22 85.62,32.97 85.85,32.66
N$92
  cutout Top: 91.19,53.34 91.19,50.8 94.36,50.8 95.63,52.07 95.35,52.32 95.12,52.5 94.89,52.65 94.64,52.81 94.39,52.93 94.08,53.06 93.7,53.19 93.37,53.26 93.01,53.31 92.71,53.34
N$93
  cutout Top: 96.27,51.44 95,50.16 95,43.81 96.52,42.29 97.54,42.29 97.54,48.49 97.51,48.79 97.46,49.15 97.41,49.38 97.36,49.56 97.26,49.86 97.18,50.04 97.05,50.32 96.9,50.6 96.75,50.85 96.52,51.16
N$94
  cutout Top: 91.19,53.34 91.19,50.8 88.01,50.8 86.74,52.07 87.02,52.32 87.25,52.5 87.48,52.65 87.73,52.81 87.99,52.93 88.29,53.06 88.67,53.19 89,53.26 89.36,53.31 89.66,53.34
N$95
  cutout Top: 86.11,51.44 87.38,50.16 87.38,43.81 85.85,42.29 84.84,42.29 84.84,48.49 84.86,48.79 84.91,49.15 84.96,49.38 85.01,49.56 85.12,49.86 85.19,50.04 85.32,50.32 85.47,50.6 85.62,50.85 85.85,51.16
N$96
  cutout Top: 86.74,41.91 88.01,40.64 94.36,40.64 95.63,41.91 94.36,43.18 88.01,43.18
N$97
  cutout Bottom: 91.19,30.48 91.19,33.02 94.36,33.02 95.63,31.75 95.35,31.5 95.12,31.32 94.89,31.17 94.64,31.01 94.39,30.89 94.08,30.76 93.7,30.63 93.37,30.56 93.01,30.51 92.71,30.48
N$98
  cutout Bottom: 96.27,32.38 95,33.66 95,40.01 96.52,41.53 97.54,41.53 97.54,35.33 97.51,35.03 97.46,34.67 97.41,34.44 97.36,34.26 97.26,33.96 97.18,33.78 97.05,33.5 96.9,33.22 96.75,32.97 96.52,32.66
N$99
  cutout Bottom: 91.19,30.48 91.19,33.02 88.01,33.02 86.74,31.75 87.02,31.5 87.25,31.32 87.48,31.17 87.73,31.01 87.99,30.89 88.29,30.76 88.67,30.63 89,30.56 89.36,30.51 89.66,30.48
N$100
  cutout Bottom: 86.11,32.38 87.38,33.66 87.38,40.01 85.85,41.53 84.84,41.53 84.84,35.33 84.86,35.03 84.91,34.67 84.96,34.44 85.01,34.26 85.12,33.96 85.19,33.78 85.32,33.5 85.47,33.22 85.62,32.97 85.85,32.66
N$101
  cutout Bottom: 91.19,53.34 91.19,50.8 94.36,50.8 95.63,52.07 95.35,52.32 95.12,52.5 94.89,52.65 94.64,52.81 94.39,52.93 94.08,53.06 93.7,53.19 93.37,53.26 93.01,53.31 92.71,53.34
N$102
  cutout Bottom: 96.27,51.44 95,50.16 95,43.81 96.52,42.29 97.54,42.29 97.54,48.49 97.51,48.79 97.46,49.15 97.41,49.38 97.36,49.56 97.26,49.86 97.18,50.04 97.05,50.32 96.9,50.6 96.75,50.85 96.52,51.16
N$103
  cutout Bottom: 91.19,53.34 91.19,50.8 88.01,50.8 86.74,52.07 87.02,52.32 87.25,52.5 87.48,52.65 87.73,52.81 87.99,52.93 88.29,53.06 88.67,53.19 89,53.26 89.36,53.31 89.66,53.34
N$104
  cutout Bottom: 86.11,51.44 87.38,50.16 87.38,43.81 85.85,42.29 84.84,42.29 84.84,48.49 84.86,48.79 84.91,49.15 84.96,49.38 85.01,49.56 85.12,49.86 85.19,50.04 85.32,50.32 85.47,50.6 85.62,50.85 85.85,51.16
N$105
  cutout Bottom: 86.74,41.91 88.01,40.64 94.36,40.64 95.63,41.91 94.36,43.18 88.01,43.18
SEG1
  Top 0.152: R2.2 D1S1.A 54.75,23.76 55.12,24.13 72.52,24.13 | 72.52,24.13 89.92,24.13 90.31,23.74 D3S1.A | D2S1.A 72.53,24.12 72.52,24.13
SEG2
  Top 0.152: R3.2 49.15,21.59 | 49.15,21.59 51.05,21.59 51.82,20.83 67.18,20.83 | 67.18,20.83 84.33,20.83 84.84,20.32 84.84,17.27 85.22,16.89 86.09,16.89 D3S2.A | D1S2.A 49.65,16.9 49.15,17.4 49.15,21.59 | D2S2.A 67.68,16.9 67.06,17.53 67.06,20.7 67.18,20.83
SEG3
  Top 0.152: R4.2 46.74,20.32 48.01,19.05 48.01,16.51 49.28,15.24 60.71,15.24 | 60.71,15.24 78.49,15.24 | 78.49,15.24 93.73,15.24 95.39,16.9 D3S3.A | DIS3.A 60.71,15.24 | D2S3.A 78.49,15.24
SEG4
  Top 0.152: 54.74,14.86 49.15,14.86 47.62,16.38 47.62,18.29 46.86,19.05 R5.2 | 54.74,14.86 72.52,14.86 | 72.52,14.86 89.03,14.86 90.31,13.58 D3S4.A | D2S4.A 72.53,14.85 72.52,14.86 | D1S4.A 54.75,14.85 54.74,14.86
SEG5
  Top 0.152: R6.2 46.61,17.78 47.24,17.14 47.24,14.73 50.55,11.43 | 67.06,10.16 51.82,10.16 50.55,11.43 | 67.06,10.16 83.57,10.16 84.2,9.53 84.2,7.62 85.08,6.74 D3S5.A | D2S5.A 67.42,6.74 67.06,7.11 67.06,10.16 | D1S5.A 49.77,6.74 49.28,7.24 49.28,10.16 50.55,11.43
SEG6
  Top 0.152: R7.2 46.23,16.51 46.86,15.88 46.86,14.48 48.77,12.57 48.77,5.59 49.28,5.08 60.71,5.08 | 60.71,5.08 78.49,5.08 | 78.49,5.08 95.63,5.08 96.27,5.71 D3S6.A | D2S6.A 78.49,5.08 | D1S6.A 60.71,5.08
SEG7
  Top 0.152: R8.2 45.34,15.24 48.26,12.32 48.26,5.46 52.45,1.27 54.74,1.27 | 54.74,1.27 72.52,1.27 | 72.52,1.27 89.92,1.27 90.31,1.66 D3S7.A | D2S7.A 72.53,1.28 72.52,1.27 | D1S7.A 54.75,1.28 54.74,1.27
V_BATT  (via drill 0.38)
  Top 0.152: U1.18 36.18,11.45 C2.1 36.58,10.8 R13.2 | U1.4 v27.69,12.95 | v27.69,12.95 | J1.2 27.3,4.19 25.4,4.19 22.78,6.81 U$31.P$1 18.34,6.81 17.53,7.62 17.53,12.7 18.62,13.79 U$32.P$1 23.67,13.79 24.51,12.95 v27.69,12.95
  Top 0.254: v36.45,15.75 37.59,15.75 38.48,14.86 38.48,11.43 37.85,10.8 36.58,10.8 | S3.2 34.46,21.12 v32.77,19.43
  Bottom 0.254: v36.45,15.75 v32.77,19.43 29.34,19.43 27.69,17.78 v27.69,12.95
V_EXT  (via drill 0.38)
  Top 0.508: v31.62,20.32 32.96,21.65 S3.1
  Bottom 0.508: J9.1 26.67,17.78 29.21,20.32 v31.62,20.32